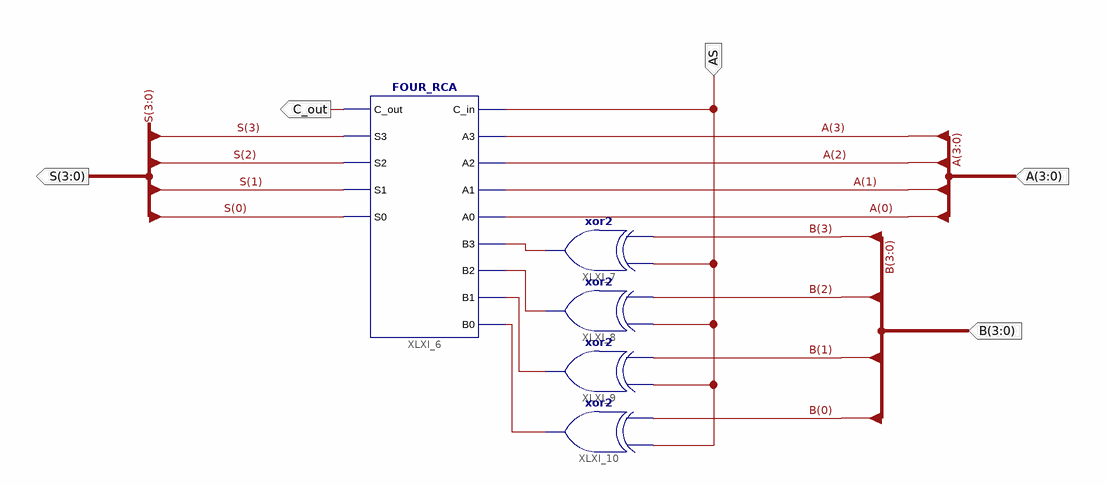
[diagram p0: schematic sheet 1]
// Xilinx ISE schematic Add_Sub_4_bit.sch (spartan3e) as structural Verilog: 5 symbols, 5 ports
module Add_Sub_4_bit (
  input  AS,
  input  [3:0] A,
  input  [3:0] B,
  output C_out,
  output [3:0] S
);

  wire XLXN_60, XLXN_61, XLXN_62, XLXN_63;

  xor XLXI_7 (XLXN_60, B[3], AS);
  xor XLXI_8 (XLXN_61, B[2], AS);
  xor XLXI_9 (XLXN_62, B[1], AS);
  xor XLXI_10 (XLXN_63, B[0], AS);
  FOUR_RCA XLXI_6 (
    .A0(A[0]), .A1(A[1]), .A2(A[2]), .A3(A[3]), .B0(XLXN_63), .B1(XLXN_62), .B2(XLXN_61), .B3(XLXN_60),
    .C_in(AS), .C_out(C_out), .S0(S[0]), .S1(S[1]), .S2(S[2]), .S3(S[3]));
endmodule
